# Altium schematic sheet 04-LcdTFT3.2inch.SchDoc
size A4
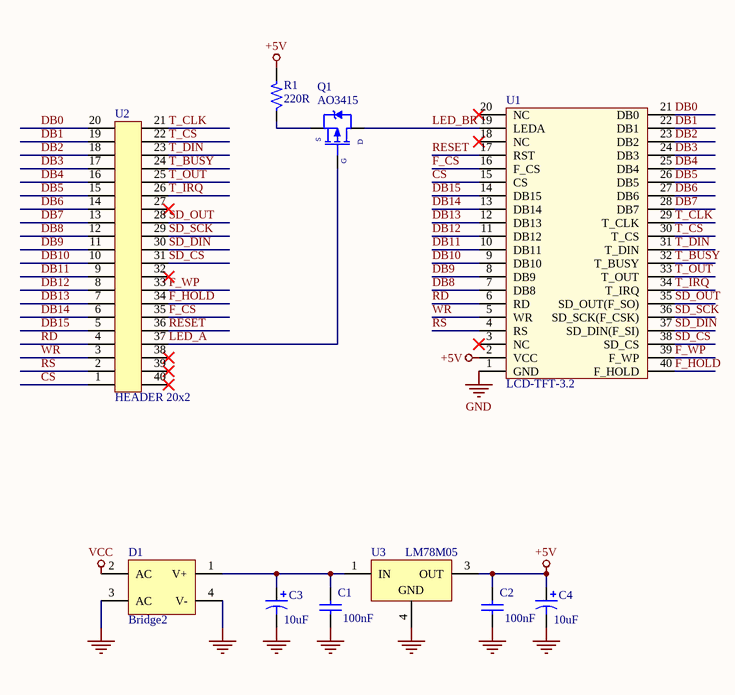
[diagram p0: 04-LcdTFT3.2inch.SchDoc]

## Parts
C1  value 100nF  [RAD-0.3]  (hidden comment: 104)
C2  value 100nF  [RAD-0.3]  (hidden comment: 104)
C3  value 10uF  [RB7.6-15]  (hidden comment: 10uF/16V)
C4  value 10uF  [RB7.6-15]  (hidden comment: 10uF/16V)
D1  Bridge2  [D-46_6A]
Q1  AO3415  [SOT-23-3]
R1  220R  [R-0805]
U1  LCD-TFT-3.2  [LCD-TFT-3.2']
U2  HEADER 20x2
U3  value LM78M05  [NDP0003B_M]  (hidden comment: LM78M05CDTX)

## Nets
+5V: C2.1 C4.1 R1.2 U1.2(VCC) U3.3(OUT)
GND: C1.2 C2.2 C3.2 C4.2 D1.3(AC) D1.4(V-) U1.1(GND) U3.4(GND)
VCC: D1.2(AC)
CS: U1.15(CS) U2.1
DB0: U1.21(DB0) U2.20
DB1: U1.22(DB1) U2.19
DB2: U1.23(DB2) U2.18
DB3: U1.24(DB3) U2.17
DB4: U1.25(DB4) U2.16
DB5: U1.26(DB5) U2.15
DB6: U1.27(DB6) U2.14
DB7: U1.28(DB7) U2.13
DB8: U1.7(DB8) U2.12
DB9: U1.8(DB9) U2.11
DB10: U1.9(DB10) U2.10
DB11: U1.10(DB11) U2.9
DB12: U1.11(DB12) U2.8
DB13: U1.12(DB13) U2.7
DB14: U1.13(DB14) U2.6
DB15: U1.14(DB15) U2.5
F_CS: U1.16(F_CS) U2.35
F_HOLD: U1.40(F_HOLD) U2.34
F_WP: U1.39(F_WP) U2.33
LED_A: Q1.1(G) U2.37
LED_BR: Q1.3(D) U1.19(LEDA)
RD: U1.6(RD) U2.4
RESET: U1.17(RST) U2.36
RS: U1.4(RS) U2.2
SD_CS: U1.38(SD_CS) U2.31
SD_DIN: U1.37(SD_DIN(F_SI)) U2.30
SD_OUT: U1.35(SD_OUT(F_SO)) U2.28
SD_SCK: U1.36(SD_SCK(F_CSK)) U2.29
T_BUSY: U1.32(T_BUSY) U2.24
T_CLK: U1.29(T_CLK) U2.21
T_CS: U1.30(T_CS) U2.22
T_DIN: U1.31(T_DIN) U2.23
T_IRQ: U1.34(T_IRQ) U2.26
T_OUT: U1.33(T_OUT) U2.25
WR: U1.5(WR) U2.3
NetC1_1: C1.1 C3.1 D1.1(V+) U3.1(IN)
NetQ1_2: Q1.2(S) R1.1

Not connected (* = marked no-connect by the designer): U1 3(NC)* 18(NC)* 20(NC)*; U2 27* 32* 38* 39* 40*

## Library data of the parts
C1 C2 = Cap: Capacitor; Published: 8-Jun-2000; LatestRevisionDate: 17-Jul-2002; LatestRevisionNote: Re-released for DXP Platform.; PackageReference: RAD-0.3; Publisher: Altium Limited; PackageDescription: Radial Cap, Thru-Hole; 2 Leads; 0.3 in Pin Spacing
C3 C4 = Cap Pol1: Polarized Capacitor (Radial); Published: 8-Jun-2000; LatestRevisionDate: 17-Jul-2002; LatestRevisionNote: Re-released for DXP Platform.; PackageReference: RB7.6-15; Publisher: Altium Limited; PackageDescription: Polarized Capacitor (Radial); 2 Leads
D1 = Bridge2: Diode Bridge; Published: 24-Mar-1999; LatestRevisionDate: 17-Jul-2002; LatestRevisionNote: Re-released for DXP Platform.; PackageReference: D-46_6A; Publisher: Altium Limited; PackageDescription: Bridge Rectifier; 4 Terminals; Body 16.8 x 16.8 mm (typ); Pitch 10.67 mm
Q1 = IRF9540: HEXFET P-Channel Power MOSFET; Note: Pin 2 is electrically connected to pin 4.; Published: 8-Jun-2000; LatestRevisionDate: 17-Jul-2002; LatestRevisionNote: Re-released for DXP Platform.; DatasheetVersion: PD-9.421C; PackageVersion: Feb-1997; PackageReference: TO-220AB; Publisher: Altium Limited; PackageDescription: TO, Thru-Hole, Vertical, Heatsink Mounted; 3 In-Line Leads; Pitch 2.54 mm; ComponentLink1Description: Manufacturer Link; ComponentLink1URL: http://www.irf.com/; ComponentLink2Description: Datasheet; ComponentLink2URL: http://www.irf.com/product-info/datasheets/data/irf9540.pdf
R1 = R: Resistor 1/4W; Value: R1/4W - 1K
U2 = JP20x2: Value: JP20x2
U3 = CMP-0062-00204-3: 3-Terminal Positive Voltage Regulators, 3-pin TO-252; Manufacturer: Texas Instruments; PackageTopMarking: NSUZXYTT*LM78M05*CDT; PowerWise: N; CompType: LDO IC; ComponentLink1Description: Datasheet URL; ComponentLink1URL: http://www.ti.com/general/docs/lit/getliterature.tsp?genericPartNumber=LM78M05&fileType=pdf; PackageReference: NDP0003B; Code_JEDEC: TO-252-AA; PinCount: 3; PackageDescription: TO252, Molded, Jedec, 6.8 x 6.10 x 2.30mm Body, 3 Lead, 2.28mm Pitch, Surface Mount
U1 = LCD-TFT-3.2: Value: LCD-TFT-3.2